# Altium schematic sheet Processor.SchDoc
size 420 x 297 mm; SheetNumber: 5; SheetTotal: 14; PageSetup: Record=PageOptions|CenterHorizontal=True|CenterVertical=True|PrintScale=0.96|XCorrection=1.00|YCorrection=1.00|PrintKind=1|BorderSize=5000000|LeftOffset=0|BottomOffset=0|Orientation=2|PaperLength=4318|PaperWidth=2794|Scale=100|PaperSource=7|PrintQuality=600|MediaType=1|DitherType=10|PaperKind=11" x 17"|PrintScaleMode=1
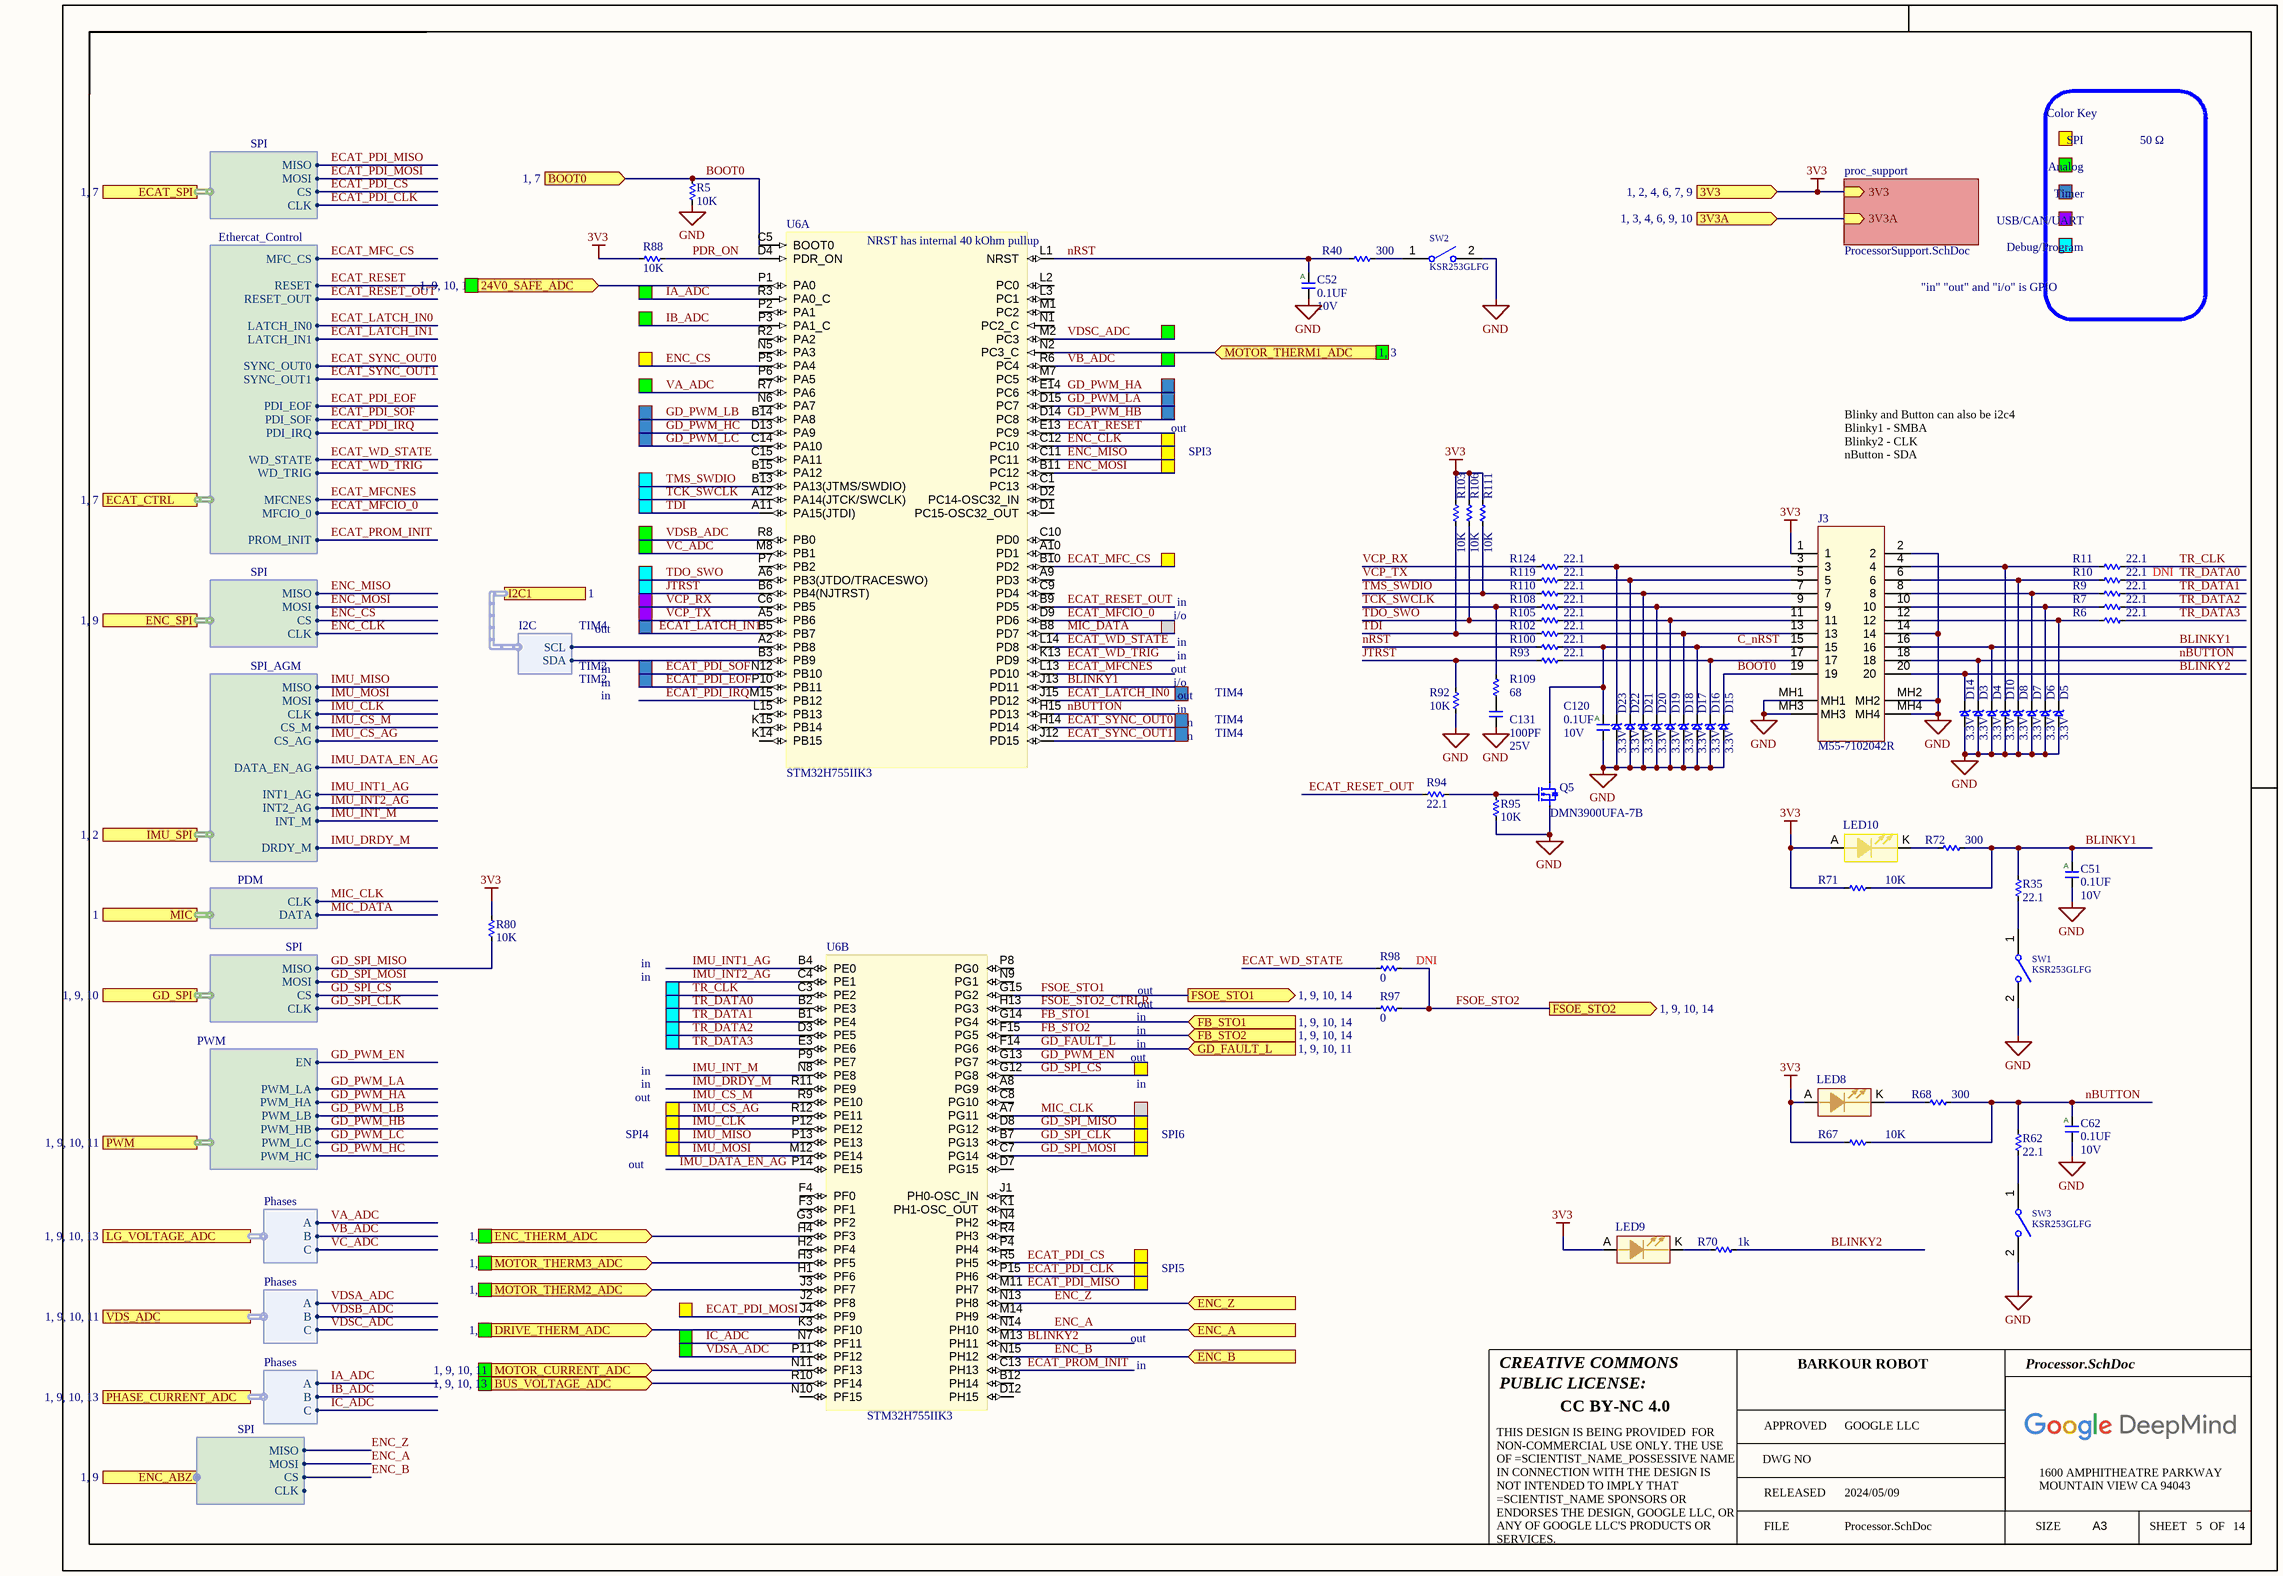
[diagram p0: Processor.SchDoc]

## Parts
C51  value 0.1UF  Voltage: 10V  [C0201]  (hidden comment: __Template_Cap_Auto)
C52  value 0.1UF  Voltage: 10V  [C0201]  (hidden comment: __Template_Cap_Auto)
C62  value 0.1UF  Voltage: 10V  [C0201]  (hidden comment: __Template_Cap_Auto)
C120  value 0.1UF  Voltage: 10V  [C0201]  (hidden comment: __Template_Cap_Auto)
C131  value 100PF  Voltage: 25V  [C0201]  (hidden comment: __Template_Cap)
D3  3.3V  [SOD1060X40]
D4  3.3V  [SOD1060X40]
D5  3.3V  [SOD1060X40]
D6  3.3V  [SOD1060X40]
D7  3.3V  [SOD1060X40]
D8  3.3V  [SOD1060X40]
D10  3.3V  [SOD1060X40]
D14  3.3V  [SOD1060X40]
D15  3.3V  [SOD1060X40]
D16  3.3V  [SOD1060X40]
D17  3.3V  [SOD1060X40]
D18  3.3V  [SOD1060X40]
D19  3.3V  [SOD1060X40]
D20  3.3V  [SOD1060X40]
D21  3.3V  [SOD1060X40]
D22  3.3V  [SOD1060X40]
D23  3.3V  [SOD1060X40]
J3  M55-7102042R  [CON_M55-7102042R]
LED8  __Template_LED_ORANGE_AK  [LED_APG0603SYC-TT]  (value not drawn)
LED9  __Template_LED_ORANGE_AK  [LED_APG0603SYC-TT]  (value not drawn)
LED10  __Template_LED_YELLOW_AK  [LED_APG0603SYC-TT]  (value not drawn)
Q5  MFG P/N: DMN3900UFA-7B  [3XDFN]  (hidden comment: NFET_DMN3900UFA)
R5  value 10K  [R0201]  (hidden comment: __Template_Resistor)
R6  value 22.1  [R0201]  (hidden comment: __Template_Resistor)
R7  value 22.1  [R0201]  (hidden comment: __Template_Resistor)
R9  value 22.1  [R0201]  (hidden comment: __Template_Resistor)
R10  value 22.1  [R0201]  (hidden comment: __Template_Resistor)
R11  value 22.1  [R0201]  (hidden comment: __Template_Resistor)
R35  value 22.1  [R0201]  (hidden comment: __Template_Resistor)
R40  value 300  [R0201]  (hidden comment: __Template_Resistor)
R62  value 22.1  [R0201]  (hidden comment: __Template_Resistor)
R67  value 10K  [R0201]  (hidden comment: __Template_Resistor)
R68  value 300  [R0201]  (hidden comment: __Template_Resistor)
R70  value 1k  [R0201]  (hidden comment: __Template_Resistor)
R71  value 10K  [R0201]  (hidden comment: __Template_Resistor)
R72  value 300  [R0201]  (hidden comment: __Template_Resistor)
R80  value 10K  [R0201]  (hidden comment: __Template_Resistor)
R88  value 10K  [R0201]  (hidden comment: __Template_Resistor)
R92  value 10K  [R0201]  (hidden comment: __Template_Resistor)
R93  value 22.1  [R0201]  (hidden comment: __Template_Resistor)
R94  value 22.1  [R0201]  (hidden comment: __Template_Resistor)
R95  value 10K  [R0201]  (hidden comment: __Template_Resistor)
R97  0  [R0402]
R98  0  [R0402]
R100  value 22.1  [R0201]  (hidden comment: __Template_Resistor)
R102  value 22.1  [R0201]  (hidden comment: __Template_Resistor)
R103  value 10K  [R0201]  (hidden comment: __Template_Resistor)
R105  value 22.1  [R0201]  (hidden comment: __Template_Resistor)
R106  value 10K  [R0201]  (hidden comment: __Template_Resistor)
R108  value 22.1  [R0201]  (hidden comment: __Template_Resistor)
R109  value 68  [R0201]  (hidden comment: __Template_Resistor)
R110  value 22.1  [R0201]  (hidden comment: __Template_Resistor)
R111  value 10K  [R0201]  (hidden comment: __Template_Resistor)
R119  value 22.1  [R0201]  (hidden comment: __Template_Resistor)
R124  value 22.1  [R0201]  (hidden comment: __Template_Resistor)
SW1  KSR253GLFG  [SW_KSR253GLFG]
SW2  KSR253GLFG  [SW_KSR253GLFG]
SW3  KSR253GLFG  [SW_KSR253GLFG]
U6  MFG P/N: STM32H755IIK3  [BGS201C65P15X15_1000X1000X60]  (hidden comment: MCU_STM32H755IIK3)  (parts A,B of 3)

## Sub-sheets
proc_support = ProcessorSupport.SchDoc: 3V3 (in), 3V3A (in)

## Ports
3V3 (in, see 1, 2, 4, 6, 7, 9), 3V3A (in, see 1, 3, 4, 6, 9, 10), 24V0_SAFE_ADC (in, see 1, 9, 10, 14), BOOT0 (in, see 1, 7), BUS_VOLTAGE_ADC (in, see 1, 9, 10, 13), DRIVE_THERM_ADC (in, see 1, 3), ECAT_CTRL (harness Ethercat_Control, see 1, 7), ECAT_SPI (harness SPI, see 1, 7), ENC_A (in), ENC_ABZ (harness SPI, see 1, 9), ENC_B (in), ENC_SPI (harness SPI, see 1, 9), ENC_THERM_ADC (in, see 1, 3), ENC_Z (in), FB_STO1 (in, see 1, 9, 10, 14), FB_STO2 (in, see 1, 9, 10, 14), FSOE_STO1 (out, see 1, 9, 10, 14), FSOE_STO2 (out, see 1, 9, 10, 14), GD_FAULT_L (in, see 1, 9, 10, 11), GD_SPI (harness SPI, see 1, 9, 10), I2C1 (harness I2C, see 1), IMU_SPI (harness SPI_AGM, see 1, 2), LG_VOLTAGE_ADC (harness Phases, see 1, 9, 10, 13), MIC (harness PDM, see 1), MOTOR_CURRENT_ADC (in, see 1, 9, 10, 11), MOTOR_THERM1_ADC (in, see 1, 3), MOTOR_THERM2_ADC (in, see 1, 3), MOTOR_THERM3_ADC (in, see 1, 3), PHASE_CURRENT_ADC (harness Phases, see 1, 9, 10, 13), PWM (harness PWM, see 1, 9, 10, 11), VDS_ADC (harness Phases, see 1, 9, 10, 11)

## Harnesses
SPI: CLK, CS, MOSI, MISO
PDM: DATA, CLK
SPI: MISO, MOSI, CS, CLK
Ethercat_Control: MFC_CS, LATCH_IN0, LATCH_IN1, RESET_OUT, SYNC_OUT0, SYNC_OUT1, PDI_EOF, PDI_SOF, PDI_IRQ, RESET, WD_STATE, WD_TRIG, MFCNES, MFCIO_0, PROM_INIT
SPI_AGM: CLK, MOSI, CS_AG, DATA_EN_AG, CS_M, MISO, INT1_AG, INT2_AG, INT_M, DRDY_M
PWM: EN, PWM_LA, PWM_HA, PWM_LB, PWM_HB, PWM_LC, PWM_HC
Phases: A, B, C
I2C: SDA, SCL

## Nets
3V3: J3.1 LED8.A LED9.A LED10.A R67.2 R71.2 R80.2 R88.2 R103.2 R106.2 R111.2 ; port 3V3, sheet proc_support/3V3
GND: C51.2 C52.2 C62.2 C120.2 C131.2 D3.A D4.A D5.A D6.A D7.A D8.A D10.A D14.A D15.A D16.A D17.A D18.A D19.A D20.A D21.A D22.A D23.A J3.2 J3.14 J3.MH1 J3.MH2 J3.MH3 J3.MH4 Q5.2(S) R5.1 R92.1 R95.1 SW1.2 SW2.2 SW3.2
3V3A: port 3V3A, sheet proc_support/3V3A
24V0_SAFE_ADC: U6.P1(PA0) ; port 24V0_SAFE_ADC
BLINKY1: C51.1 D4.K J3.16 R35.1 R71.1 R72.2 U6.J13(PD11)
BLINKY2: D14.K J3.20 R70.2 U6.M13(PH11)
BOOT0: D15.K J3.19 R5.2 U6.C5(BOOT0) ; port BOOT0
BUS_VOLTAGE_ADC: U6.R10(PF14) ; port BUS_VOLTAGE_ADC
C_nRST: C120.1 D17.K J3.15 Q5.3(D) R100.2
DRIVE_THERM_ADC: U6.K3(PF10) ; port DRIVE_THERM_ADC
ECAT_LATCH_IN0: U6.J15(PD12) ; port ECAT_CTRL.LATCH_IN0
ECAT_LATCH_IN1: U6.B5(PB7) ; port ECAT_CTRL.LATCH_IN1
ECAT_MFC_CS: U6.B10(PD2) ; port ECAT_CTRL.MFC_CS
ECAT_MFCIO_0: U6.D9(PD6) ; port ECAT_CTRL.MFCIO_0
ECAT_MFCNES: U6.L13(PD10) ; port ECAT_CTRL.MFCNES
ECAT_PDI_CLK: U6.P15(PH6) ; port ECAT_SPI.CLK
ECAT_PDI_CS: U6.R5(PH5) ; port ECAT_SPI.CS
ECAT_PDI_EOF: U6.P10(PB11) ; port ECAT_CTRL.PDI_EOF
ECAT_PDI_IRQ: U6.M15(PB12) ; port ECAT_CTRL.PDI_IRQ
ECAT_PDI_MISO: U6.M11(PH7) ; port ECAT_SPI.MISO
ECAT_PDI_MOSI: U6.J4(PF9) ; port ECAT_SPI.MOSI
ECAT_PDI_SOF: U6.N12(PB10) ; port ECAT_CTRL.PDI_SOF
ECAT_PROM_INIT: U6.C13(PH13) ; port ECAT_CTRL.PROM_INIT
ECAT_RESET: U6.E13(PC9) ; port ECAT_CTRL.RESET
ECAT_RESET_OUT: R94.1 U6.B9(PD5) ; port ECAT_CTRL.RESET_OUT
ECAT_SYNC_OUT0: U6.H14(PD14) ; port ECAT_CTRL.SYNC_OUT0
ECAT_SYNC_OUT1: U6.J12(PD15) ; port ECAT_CTRL.SYNC_OUT1
ECAT_WD_STATE: R98.2 U6.L14(PD8) ; port ECAT_CTRL.WD_STATE
ECAT_WD_TRIG: U6.K13(PD9) ; port ECAT_CTRL.WD_TRIG
ENC_A: U6.N14(PH10) ; port ENC_A, port ENC_ABZ.MOSI
ENC_B: U6.N15(PH12) ; port ENC_B, port ENC_ABZ.CS
ENC_CLK: U6.C12(PC10) ; port ENC_SPI.CLK
ENC_CS: U6.P5(PA4) ; port ENC_SPI.CS
ENC_MISO: U6.C11(PC11) ; port ENC_SPI.MISO
ENC_MOSI: U6.B11(PC12) ; port ENC_SPI.MOSI
ENC_THERM_ADC: U6.H4(PF3) ; port ENC_THERM_ADC
ENC_Z: U6.N13(PH8) ; port ENC_Z, port ENC_ABZ.MISO
FB_STO1: U6.G14(PG4) ; port FB_STO1
FB_STO2: U6.F15(PG5) ; port FB_STO2
FSOE_STO1: U6.G15(PG2) ; port FSOE_STO1
FSOE_STO2: R97.1 R98.1 ; port FSOE_STO2
FSOE_STO2_CTRLR: R97.2 U6.H13(PG3)
GD_FAULT_L: U6.F14(PG6) ; port GD_FAULT_L
GD_PWM_EN: U6.G13(PG7) ; port PWM.EN
GD_PWM_HA: U6.E14(PC6) ; port PWM.PWM_HA
GD_PWM_HB: U6.D14(PC8) ; port PWM.PWM_HB
GD_PWM_HC: U6.D13(PA9) ; port PWM.PWM_HC
GD_PWM_LA: U6.D15(PC7) ; port PWM.PWM_LA
GD_PWM_LB: U6.B14(PA8) ; port PWM.PWM_LB
GD_PWM_LC: U6.C14(PA10) ; port PWM.PWM_LC
GD_SPI_CLK: U6.B7(PG13) ; port GD_SPI.CLK
GD_SPI_CS: U6.G12(PG8) ; port GD_SPI.CS
GD_SPI_MISO: R80.1 U6.D8(PG12) ; port GD_SPI.MISO
GD_SPI_MOSI: U6.C7(PG14) ; port GD_SPI.MOSI
IA_ADC: U6.R3(PA0_C) ; port PHASE_CURRENT_ADC.A
IB_ADC: U6.P3(PA1_C) ; port PHASE_CURRENT_ADC.B
IC_ADC: U6.N7(PF11) ; port PHASE_CURRENT_ADC.C
IMU_CLK: U6.P12(PE12) ; port IMU_SPI.CLK
IMU_CS_AG: U6.R12(PE11) ; port IMU_SPI.CS_AG
IMU_CS_M: U6.R9(PE10) ; port IMU_SPI.CS_M
IMU_DATA_EN_AG: U6.P14(PE15) ; port IMU_SPI.DATA_EN_AG
IMU_DRDY_M: U6.R11(PE9) ; port IMU_SPI.DRDY_M
IMU_INT1_AG: U6.B4(PE0) ; port IMU_SPI.INT1_AG
IMU_INT2_AG: U6.C4(PE1) ; port IMU_SPI.INT2_AG
IMU_INT_M: U6.N8(PE8) ; port IMU_SPI.INT_M
IMU_MISO: U6.P13(PE13) ; port IMU_SPI.MISO
IMU_MOSI: U6.M12(PE14) ; port IMU_SPI.MOSI
JTRST: R92.2 R93.1 U6.B6(PB4(NJTRST))
MIC_CLK: U6.A7(PG11) ; port MIC.CLK
MIC_DATA: U6.B8(PD7) ; port MIC.DATA
MOTOR_CURRENT_ADC: U6.N11(PF13) ; port MOTOR_CURRENT_ADC
MOTOR_THERM1_ADC: U6.N2(PC3_C) ; port MOTOR_THERM1_ADC
MOTOR_THERM2_ADC: U6.J3(PF7) ; port MOTOR_THERM2_ADC
MOTOR_THERM3_ADC: U6.H3(PF5) ; port MOTOR_THERM3_ADC
nBUTTON: C62.1 D3.K J3.18 R62.1 R67.1 R68.1 U6.H15(PD13)
nRST: C52.1 R40.1 R100.1 U6.L1(NRST)
PDR_ON: R88.1 U6.D4(PDR_ON)
TCK_SWCLK: R108.1 R109.2 U6.A12(PA14(JTCK/SWCLK))
TDI: R102.1 R103.1 U6.A11(PA15(JTDI))
TDO_SWO: R105.1 R106.1 U6.A6(PB3(JTDO/TRACESWO))
TMS_SWDIO: R110.1 R111.1 U6.B13(PA13(JTMS/SWDIO))
TR_CLK: R11.2 U6.C3(PE2)
TR_DATA0: R10.2 U6.B2(PE3)
TR_DATA1: R9.2 U6.B1(PE4)
TR_DATA2: R7.2 U6.D3(PE5)
TR_DATA3: R6.2 U6.E3(PE6)
VA_ADC: U6.R7(PA6) ; port LG_VOLTAGE_ADC.A
VB_ADC: U6.R6(PC4) ; port LG_VOLTAGE_ADC.B
VC_ADC: U6.M8(PB1) ; port LG_VOLTAGE_ADC.C
VCP_RX: R124.1 U6.C6(PB5)
VCP_TX: R119.1 U6.A5(PB6)
VDSA_ADC: U6.P11(PF12) ; port VDS_ADC.A
VDSB_ADC: U6.R8(PB0) ; port VDS_ADC.B
VDSC_ADC: U6.M2(PC3) ; port VDS_ADC.C
NetC131_1: C131.1 R109.1
NetD5_K: D5.K J3.12 R6.1
NetD6_K: D6.K J3.10 R7.1
NetD7_K: D7.K J3.8 R9.1
NetD8_K: D8.K J3.6 R10.1
NetD10_K: D10.K J3.4 R11.1
NetD16_K: D16.K J3.17 R93.2
NetD18_K: D18.K J3.13 R102.2
NetD19_K: D19.K J3.11 R105.2
NetD20_K: D20.K J3.9 R108.2
NetD21_K: D21.K J3.7 R110.2
NetD22_K: D22.K J3.5 R119.2
NetD23_K: D23.K J3.3 R124.2
NetLED8_K: LED8.K R68.2
NetLED9_K: LED9.K R70.1
NetLED10_K: LED10.K R72.1
NetQ5_1: Q5.1(G) R94.2 R95.2
NetR35_2: R35.2 SW1.1
NetR40_2: R40.2 SW2.1
NetR62_2: R62.2 SW3.1
NetU6_A2: U6.A2(PB8) ; port I2C1.SCL
NetU6_B3: U6.B3(PB9) ; port I2C1.SDA

Not connected (* = marked no-connect by the designer): U6 A8(PG9) A9(PD3) A10(PD1) B12(PH14) B15(PA12) C1(PC13) C8(PG10) C9(PD4) C10(PD0) C15(PA11) D1(PC15-OSC32_OUT) D2(PC14-OSC32_IN) D7(PG15) D12(PH15) F3(PF1) F4(PF0) G3(PF2) H1(PF6) H2(PF4) J1(PH0-OSC_IN) J2(PF8) K1(PH1-OSC_OUT) K14(PB15) K15(PB14) L2(PC0) L3(PC1) L15(PB13) M1(PC2) M7(PC5) M14(PH9) N1(PC2_C) N4(PH2) N5(PA3) N6(PA7) N9(PG1) N10(PF15) P2(PA1) P4(PH4) P6(PA5) P7(PB2) P8(PG0) P9(PE7) R2(PA2) R4(PH3)

## Notes on the sheet
- SPI
- Color Key
- 50 Ω
- Analog
- Timer
- (near U6) NRST has internal 40 kOhm pullup
- USB/CAN/UART
- Debug/Program
- "in" "out" and "i/o" is GPIO
- out
- SPI3
- Blinky and Button can also be i2c4
  Blinky1 - SMBA
  Blinky2 - CLK
  nButton - SDA
- in
- TIM4
- i/o
- TIM2
- SPI4
- SPI6
- SPI5
- CREATIVE COMMONS
- PUBLIC LICENSE:
- BARKOUR ROBOT
- CC BY-NC 4.0
- APPROVED
- DWG NO
- GOOGLE LLC
- FILE
- RELEASED
- 2024/05/09
- SIZE
- 1600 AMPHITHEATRE PARKWAY
- MOUNTAIN VIEW CA 94043
- A3
- SHEET
- OF
- THIS DESIGN IS BEING PROVIDED  FOR NON-COMMERCIAL USE ONLY. THE USE OF =SCIENTIST_NAME_POSSESSIVE NAME IN CONNECTION WITH THE DESIGN IS NOT INTENDED TO IMPLY THAT =SCIENTIST_NAME SPONSORS OR ENDORSES THE DESIGN, GOOGLE LLC, OR ANY OF GOOGLE LLC'S PRODUCTS OR SERVICES.
- (in symbol 934) A

## Library data of the parts
C51 C52 C62 C120 = 934: CAP, CER, X6S, 0.1uF, 10V, 10%, 0201, AUTOGRADE; MFG: MURATA; MFG P/N: GRT033C81A104KE01D; COMMON: 150-01178-00; Status: Released; Package: 0201; Supplier 1: Digi-key; ComponentLink1URL: https://search.murata.co.jp/Ceramy/image/img/A01X/G101/ENG/GRT033C81A104KE01-01.pdf; Supplier Part Number 1: 490-12232-1-ND
C131 = 767: CAP, CER, X7R, 100pF, 25V, 10%, 0201, 0.33mm T; MFG: MURATA; MFG P/N: GRM033R71E101KA01D; COMMON: 150-00022-00; Status: Released; Package: 0201; Supplier 1: Digi-Key; ComponentLink1URL: https://www.digikey.com/en/products/detail/murata-electronics/GRM033R71E101KA01D/702438; Supplier Part Number 1: 490-3172-1-ND
D3-D8 D10 D14-D23 = 192: TVS, DIODE, UNIDIR, 3.3VRWM, 4.8VBR, 7.8VCL, SOD-923; MFG: ON Semiconductor; MFG P/N: ESD9R3.3ST5G; Value: ESD9R3.3ST5G; Status: Released; Package: SOD-923; Supplier 1: Digi-Key; ComponentLink1URL: http://www.onsemi.com/pub/Collateral/ESD9R3.3S-D.PDF; Supplier Part Number 1: ESD9R3.3ST5GOSCT-ND
J3 = 1204: CONN HEADER SMD R/A 20POS 1.27MM; MFG: Harwin Inc.; Status: Released; MFG P/N: M55-7102042R; Supplier 1: Digi-Key; ComponentLink1URL: https://www.digikey.com/en/products/detail/harwin-inc/M55-7102042R/8537613?s=N4IgTCBcDaILIFYEFoDsBGADGTAWMASiALoC%2BQA; Supplier Part Number 1: 952-3893-1-ND; Value: M55-7102042R
LED8 LED9 = 308: LED, ORANGE, 611NM, 10mA, CLEAR, 0201; MFG: Kingbright; MFG P/N: APG0603SEC-TT; Value: APG0603SEC-TT; Status: Released; Package: 0201; Supplier 1: Digi-Key; ComponentLink1URL: http://www.kingbrightusa.com/images/catalog/SPEC/APG0603SEC-TT.pdf; Supplier Part Number 1: 754-2027-1-ND
LED10 = 307: LED, YELLOW, 591NM, 10mA, CLEAR, 0201; MFG: Kingbright; MFG P/N: APG0603SYC-TT; Value: APG0603SYC-TT; Status: Released; Package: 0201; Supplier 1: Digi-Key; ComponentLink1URL: http://www.kingbrightusa.com/images/catalog/SPEC/APG0603SYC-TT.pdf; Supplier Part Number 1: 754-2025-1-ND
Q5 = 24: MOSFET, N-CH, 30V, 0.55A, DMN3900; MFG: Diodes Incorporated; COMMON: 480-00750-00; Value: DMN3900UFA-7B; Status: Released; Package: 3-XFDFN; ComponentLink1URL: http://www.diodes.com/datasheets/DMN3900UFA.pdf; Supplier 1: Digi-Key; Supplier Part Number 1: DMN3900UFA-7BCT-ND
R5 R67 R71 R80 R88 R92 R95 R103 R106 R111 = 6783: RES, 10K, 1%, 1/20W, 0201, AUTOGRADE; MFG: PANASONIC; MFG P/N: ERJ1GNF1002C; COMMON: 470-00033-00; Status: Released; Package: 0201; Supplier 1: Digi-Key; ComponentLink1URL: https://industrial.panasonic.com/cdbs/www-data/pdf/RDA0000/AOA0000C304.pdf; Supplier Part Number 1: P122414CT-ND
R6 R7 R9-R11 R35 R62 R93 R94 R100 R102 R105 R108 R110 R119 R124 = 10012: RES, 22.1, 1%, 1/20W, 0201, AUTOGRADE; MFG: Panasonic Electronic Components; MFG P/N: ERJ-1GNF22R1C; Status: Released; Package: 0201; Supplier 1: Digi-Key; ComponentLink1URL: https://industrial.panasonic.com/cdbs/www-data/pdf/RDA0000/AOA0000C304.pdf; Supplier Part Number 1: P122844CT-ND
  R10: DNI: DNI
R40 R72 = 10012: RES, 300, 1%, 1/20W, 0201, AUTOGRADE; MFG: Panasonic Electronic Components; MFG P/N: ERJ-1GNF3000C; Status: Released; Package: 0201; Supplier 1: Digi-Key; ComponentLink1URL: https://www.digikey.com/en/products/detail/panasonic-electronic-components/ERJ-1GNF3000C/2036050; Supplier Part Number 1: P122911CT-ND
R68 = 10010: RES, 300, 1%, 1/20W, 0201, AUTOGRADE; MFG: Panasonic Electronic Components; MFG P/N: ERJ-1GNF3000C; Status: Released; Package: 0201; Supplier 1: Digi-Key; ComponentLink1URL: https://www.digikey.com/en/products/detail/panasonic-electronic-components/ERJ-1GNF3000C/2036050; Supplier Part Number 1: P122911CT-ND
R70 = 10010: RES, 1K, 1%, 1/20W, 0201, AUTOGRADE; MFG: Bourns Inc.; MFG P/N: CR0201AFW-1001GLF; Status: Released; Package: 0201; Supplier 1: Digi-Key; ComponentLink1URL: https://www.bourns.com/docs/product-datasheets/crxxxxa.pdf; Supplier Part Number 1: 118-CR0201AFW-1001GLFCT-ND
R97 R98 = 3: RES, 0, JUMPER, 1/16W, 0402; MFG: YAGEO; MFG P/N: RC0402FR-070RL; COMMON: 470-02332-00; Status: NRND; Package: 0402; Value: 0; Supplier 1: Digi-Key; ComponentLink1URL: https://www.digikey.com/en/products/detail/yageo/RC0402FR-070RL/2827570; Supplier Part Number 1: 311-0.0LRCT-ND
  R98: DNI: DNI
R109 = 10014: RES, 68, 1%, 1/20W, 0201, AUTOGRADE; MFG: Panasonic Electronic Components; MFG P/N: ERJ-1GNF68R0C; Status: Released; Package: 0201; Supplier 1: Digi-Key; ComponentLink1URL: https://industrial.panasonic.com/cdbs/www-data/pdf/RDA0000/AOA0000C304.pdf; Supplier Part Number 1: P123132CT-ND
SW1-SW3 = SW_2P-KSR253GLFG: SWITCH TACTILE SPST-NO 0.01A 32V; MFG: C&K; ComponentLink1URL: https://www.digikey.com/en/products/detail/c-k/KSR253GLFG/958074?s=N4IgTCBcDaINIGUBKYCsBmA4gGQGKZAF0BfIA; MFG P/N: KSR253GLFG; Supplier 1: Digi-Key; Supplier Part Number 1: 401-1708-1-ND; Value: KSR253GLFG
U6 = 112: IC, MCU, STM32H755xI, ARM, 32-BIT, 240MHZ, 128 I/O, 2MB, FLASH, 1.62V TO 3.6V, UFBGA-201; MFG: STMicroelectronics; Value: BGS201C65P15X15_1000X1000X60; Status: Released; Package: 176+25UFBGA (10x10); Supplier 1: Digi-Key; ComponentLink1URL: https://www.st.com/resource/en/datasheet/stm32h755ii.pdf; Supplier Part Number 1: 497-STM32H755IIK3-ND